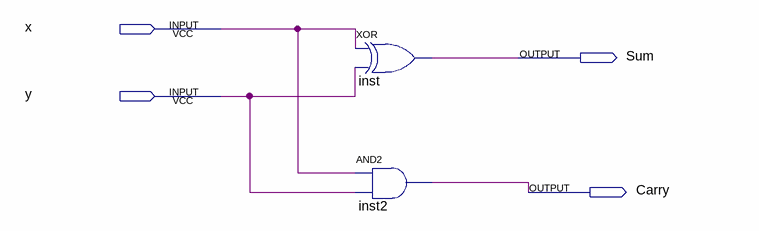
[diagram p0: schematic sheet]
// Quartus schematic lab4half.bdf as structural Verilog: 2 symbols, 4 pins
module lab4half (
  input  x,
  input  y,
  output Sum,
  output Carry
);

  xor inst (Sum, x, y);
  and inst2 (Carry, x, y);
endmodule
